# EAGLE design button_controller_v1.0 (EAGLE 9.6.2)
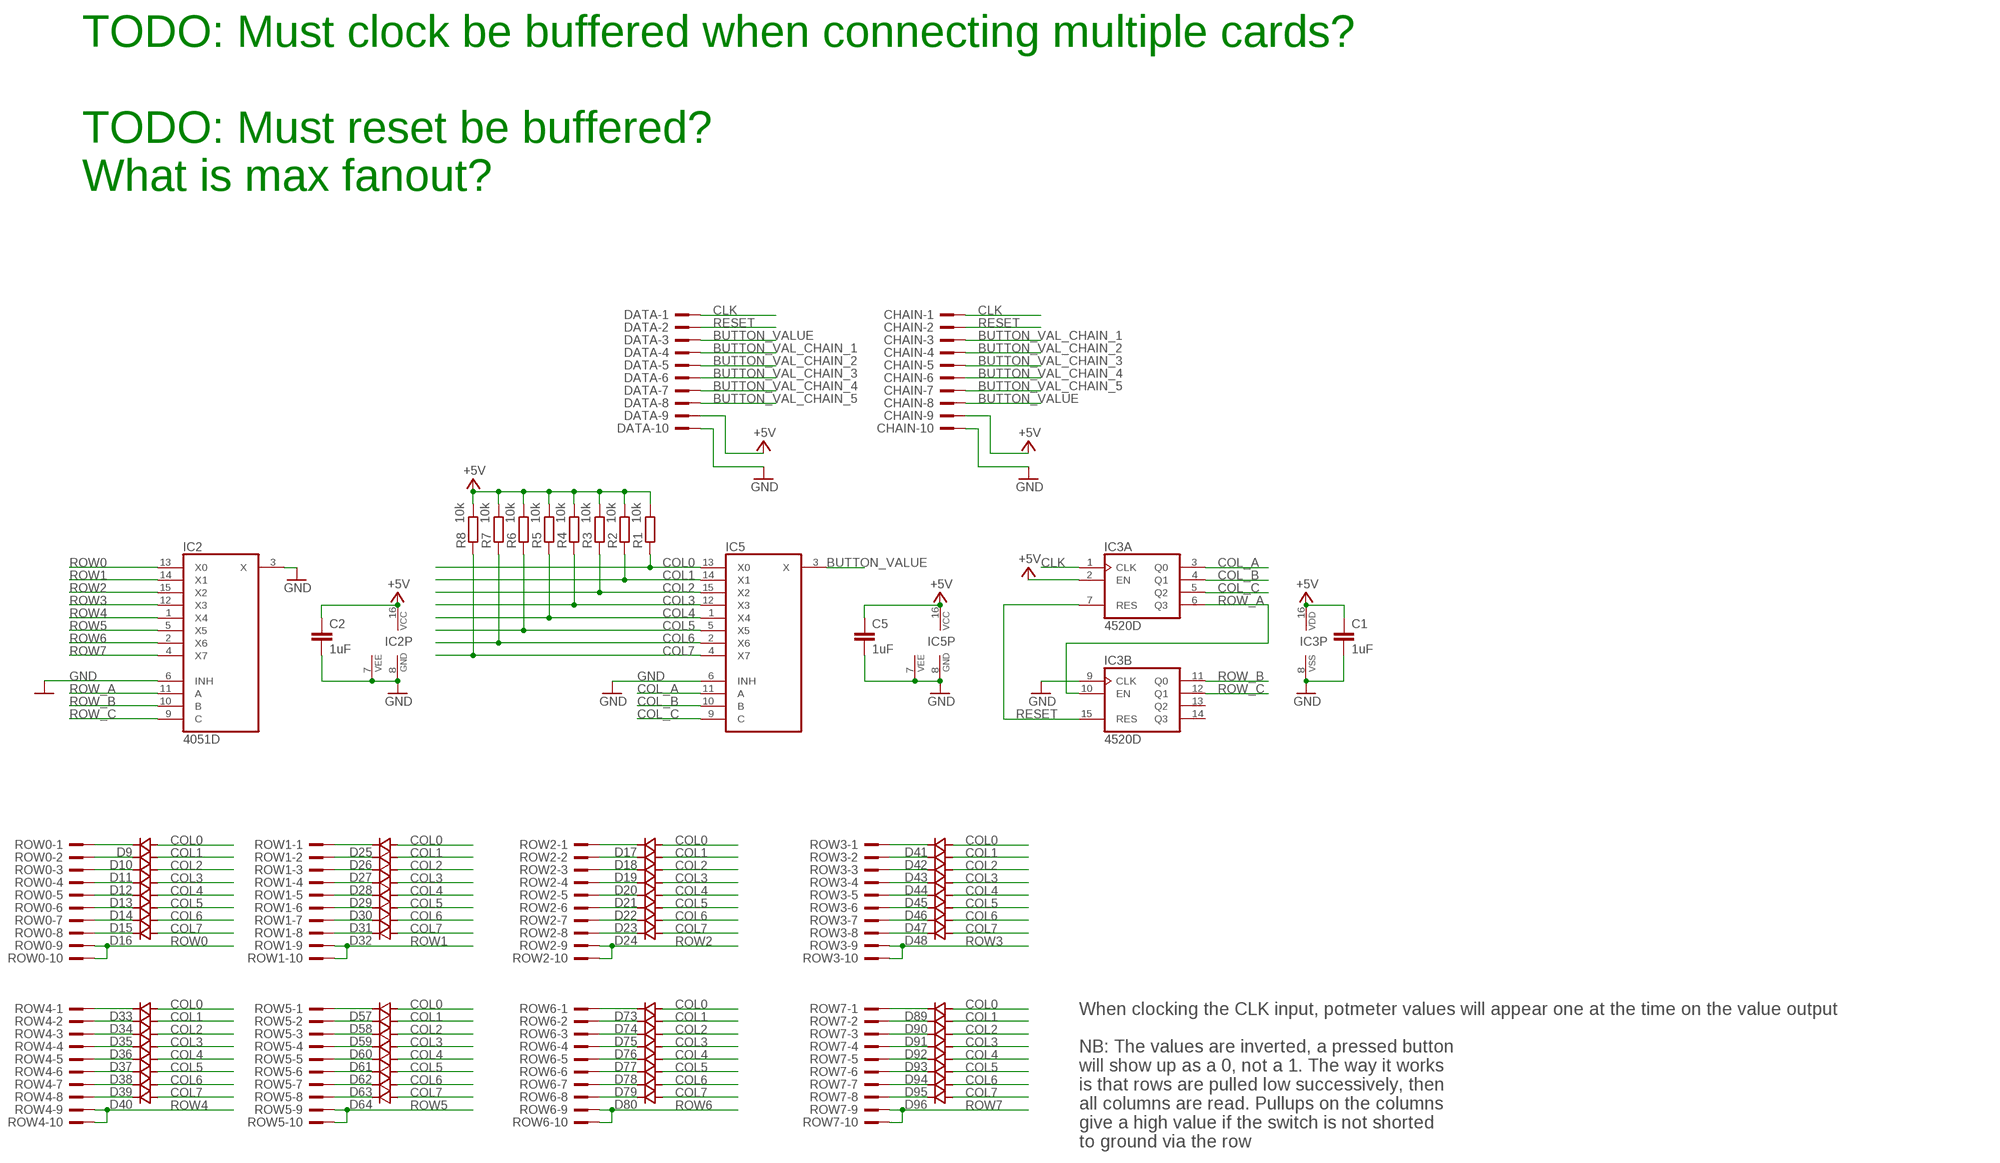
[diagram p0: schematic, sheet 1]

## Parts
C1  1uF  C-EU-J0603  [C0603-J]
C2  1uF  C-EU-J0603  [C0603-J]
C5  1uF  C-EU-J0603  [C0603-J]
CHAIN  CONN-IDC-10PS  [CONN-IDC10P-S]
D9  1N4148SOD323  [SOD323J]
D10  1N4148SOD323  [SOD323J]
D11  1N4148SOD323  [SOD323J]
D12  1N4148SOD323  [SOD323J]
D13  1N4148SOD323  [SOD323J]
D14  1N4148SOD323  [SOD323J]
D15  1N4148SOD323  [SOD323J]
D16  1N4148SOD323  [SOD323J]
D17  1N4148SOD323  [SOD323J]
D18  1N4148SOD323  [SOD323J]
D19  1N4148SOD323  [SOD323J]
D20  1N4148SOD323  [SOD323J]
D21  1N4148SOD323  [SOD323J]
D22  1N4148SOD323  [SOD323J]
D23  1N4148SOD323  [SOD323J]
D24  1N4148SOD323  [SOD323J]
D25  1N4148SOD323  [SOD323J]
D26  1N4148SOD323  [SOD323J]
D27  1N4148SOD323  [SOD323J]
D28  1N4148SOD323  [SOD323J]
D29  1N4148SOD323  [SOD323J]
D30  1N4148SOD323  [SOD323J]
D31  1N4148SOD323  [SOD323J]
D32  1N4148SOD323  [SOD323J]
D33  1N4148SOD323  [SOD323J]
D34  1N4148SOD323  [SOD323J]
D35  1N4148SOD323  [SOD323J]
D36  1N4148SOD323  [SOD323J]
D37  1N4148SOD323  [SOD323J]
D38  1N4148SOD323  [SOD323J]
D39  1N4148SOD323  [SOD323J]
D40  1N4148SOD323  [SOD323J]
D41  1N4148SOD323  [SOD323J]
D42  1N4148SOD323  [SOD323J]
D43  1N4148SOD323  [SOD323J]
D44  1N4148SOD323  [SOD323J]
D45  1N4148SOD323  [SOD323J]
D46  1N4148SOD323  [SOD323J]
D47  1N4148SOD323  [SOD323J]
D48  1N4148SOD323  [SOD323J]
D57  1N4148SOD323  [SOD323J]
D58  1N4148SOD323  [SOD323J]
D59  1N4148SOD323  [SOD323J]
D60  1N4148SOD323  [SOD323J]
D61  1N4148SOD323  [SOD323J]
D62  1N4148SOD323  [SOD323J]
D63  1N4148SOD323  [SOD323J]
D64  1N4148SOD323  [SOD323J]
D73  1N4148SOD323  [SOD323J]
D74  1N4148SOD323  [SOD323J]
D75  1N4148SOD323  [SOD323J]
D76  1N4148SOD323  [SOD323J]
D77  1N4148SOD323  [SOD323J]
D78  1N4148SOD323  [SOD323J]
D79  1N4148SOD323  [SOD323J]
D80  1N4148SOD323  [SOD323J]
D89  1N4148SOD323  [SOD323J]
D90  1N4148SOD323  [SOD323J]
D91  1N4148SOD323  [SOD323J]
D92  1N4148SOD323  [SOD323J]
D93  1N4148SOD323  [SOD323J]
D94  1N4148SOD323  [SOD323J]
D95  1N4148SOD323  [SOD323J]
D96  1N4148SOD323  [SOD323J]
DATA  CONN-IDC-10PS  [CONN-IDC10P-S]
IC2  4051D  [SO16]
IC3  4520D  [SO16]
IC5  4051D  [SO16]
R1  10k  R-EU_R0603  [R0603]
R2  10k  R-EU_R0603  [R0603]
R3  10k  R-EU_R0603  [R0603]
R4  10k  R-EU_R0603  [R0603]
R5  10k  R-EU_R0603  [R0603]
R6  10k  R-EU_R0603  [R0603]
R7  10k  R-EU_R0603  [R0603]
R8  10k  R-EU_R0603  [R0603]
ROW0  CONN-IDC-10PS  [CONN-IDC10P-S]
ROW1  CONN-IDC-10PS  [CONN-IDC10P-S]
ROW2  CONN-IDC-10PS  [CONN-IDC10P-S]
ROW3  CONN-IDC-10PS  [CONN-IDC10P-S]
ROW4  CONN-IDC-10PS  [CONN-IDC10P-S]
ROW5  CONN-IDC-10PS  [CONN-IDC10P-S]
ROW6  CONN-IDC-10PS  [CONN-IDC10P-S]
ROW7  CONN-IDC-10PS  [CONN-IDC10P-S]

## Nets
+5V: C1.1 C2.1 C5.1 CHAIN.9 DATA.9 IC2.16(VCC) IC3.2(A:EN) IC3.16(P:VDD) IC5.16(VCC) R1.2 R2.2 R3.2 R4.2 R5.2 R6.2 R7.2 R8.2
BUTTON_VAL_CHAIN_1: CHAIN.3 DATA.4
BUTTON_VAL_CHAIN_2: CHAIN.4 DATA.5
BUTTON_VAL_CHAIN_3: CHAIN.5 DATA.6
BUTTON_VAL_CHAIN_4: CHAIN.6 DATA.7
BUTTON_VAL_CHAIN_5: CHAIN.7 DATA.8
BUTTON_VALUE: CHAIN.8 DATA.3 IC5.3(X)
CLK: CHAIN.1 DATA.1 IC3.1(A:CLK)
COL0: D9.2(A) D17.2(A) D25.2(A) D33.2(A) D41.2(A) D57.2(A) D73.2(A) D89.2(A) IC5.13(X0) R1.1
COL1: D10.2(A) D18.2(A) D26.2(A) D34.2(A) D42.2(A) D58.2(A) D74.2(A) D90.2(A) IC5.14(X1) R2.1
COL2: D11.2(A) D19.2(A) D27.2(A) D35.2(A) D43.2(A) D59.2(A) D75.2(A) D91.2(A) IC5.15(X2) R3.1
COL3: D12.2(A) D20.2(A) D28.2(A) D36.2(A) D44.2(A) D60.2(A) D76.2(A) D92.2(A) IC5.12(X3) R4.1
COL4: D13.2(A) D21.2(A) D29.2(A) D37.2(A) D45.2(A) D61.2(A) D77.2(A) D93.2(A) IC5.1(X4) R5.1
COL5: D14.2(A) D22.2(A) D30.2(A) D38.2(A) D46.2(A) D62.2(A) D78.2(A) D94.2(A) IC5.5(X5) R6.1
COL6: D15.2(A) D23.2(A) D31.2(A) D39.2(A) D47.2(A) D63.2(A) D79.2(A) D95.2(A) IC5.2(X6) R7.1
COL7: D16.2(A) D24.2(A) D32.2(A) D40.2(A) D48.2(A) D64.2(A) D80.2(A) D96.2(A) IC5.4(X7) R8.1
COL_A: IC3.3(A:Q0) IC5.11(A)
COL_B: IC3.4(A:Q1) IC5.10(B)
COL_C: IC3.5(A:Q2) IC5.9(C)
GND: C1.2 C2.2 C5.2 CHAIN.10 DATA.10 IC2.3(X) IC2.6(INH) IC2.7(VEE) IC2.8(GND) IC3.8(P:VSS) IC3.9(B:CLK) IC5.6(INH) IC5.7(VEE) IC5.8(GND)
N$9: D9.1(C) ROW0.1
N$10: D10.1(C) ROW0.2
N$11: D11.1(C) ROW0.3
N$12: D12.1(C) ROW0.4
N$13: D13.1(C) ROW0.5
N$14: D14.1(C) ROW0.6
N$15: D15.1(C) ROW0.7
N$16: D16.1(C) ROW0.8
N$17: D17.1(C) ROW2.1
N$18: D18.1(C) ROW2.2
N$19: D19.1(C) ROW2.3
N$20: D20.1(C) ROW2.4
N$21: D21.1(C) ROW2.5
N$22: D22.1(C) ROW2.6
N$23: D23.1(C) ROW2.7
N$24: D24.1(C) ROW2.8
N$25: D25.1(C) ROW1.1
N$26: D26.1(C) ROW1.2
N$27: D27.1(C) ROW1.3
N$28: D28.1(C) ROW1.4
N$29: D29.1(C) ROW1.5
N$30: D30.1(C) ROW1.6
N$31: D31.1(C) ROW1.7
N$32: D32.1(C) ROW1.8
N$33: D33.1(C) ROW4.1
N$34: D34.1(C) ROW4.2
N$35: D35.1(C) ROW4.3
N$36: D36.1(C) ROW4.4
N$37: D37.1(C) ROW4.5
N$38: D38.1(C) ROW4.6
N$39: D39.1(C) ROW4.7
N$40: D40.1(C) ROW4.8
N$41: D41.1(C) ROW3.1
N$42: D42.1(C) ROW3.2
N$43: D43.1(C) ROW3.3
N$44: D44.1(C) ROW3.4
N$45: D45.1(C) ROW3.5
N$46: D46.1(C) ROW3.6
N$47: D47.1(C) ROW3.7
N$48: D48.1(C) ROW3.8
N$57: D57.1(C) ROW5.1
N$58: D58.1(C) ROW5.2
N$59: D59.1(C) ROW5.3
N$60: D60.1(C) ROW5.4
N$61: D61.1(C) ROW5.5
N$62: D62.1(C) ROW5.6
N$63: D63.1(C) ROW5.7
N$64: D64.1(C) ROW5.8
N$73: D73.1(C) ROW6.1
N$74: D74.1(C) ROW6.2
N$75: D75.1(C) ROW6.3
N$76: D76.1(C) ROW6.4
N$77: D77.1(C) ROW6.5
N$78: D78.1(C) ROW6.6
N$79: D79.1(C) ROW6.7
N$80: D80.1(C) ROW6.8
N$89: D89.1(C) ROW7.1
N$90: D90.1(C) ROW7.2
N$91: D91.1(C) ROW7.3
N$92: D92.1(C) ROW7.4
N$93: D93.1(C) ROW7.5
N$94: D94.1(C) ROW7.6
N$95: D95.1(C) ROW7.7
N$96: D96.1(C) ROW7.8
RESET: CHAIN.2 DATA.2 IC3.7(A:RES) IC3.15(B:RES)
ROW0: IC2.13(X0) ROW0.9 ROW0.10
ROW1: IC2.14(X1) ROW1.9 ROW1.10
ROW2: IC2.15(X2) ROW2.9 ROW2.10
ROW3: IC2.12(X3) ROW3.9 ROW3.10
ROW4: IC2.1(X4) ROW4.9 ROW4.10
ROW5: IC2.5(X5) ROW5.9 ROW5.10
ROW6: IC2.2(X6) ROW6.9 ROW6.10
ROW7: IC2.4(X7) ROW7.9 ROW7.10
ROW_A: IC2.11(A) IC3.6(A:Q3) IC3.10(B:EN)
ROW_B: IC2.10(B) IC3.11(B:Q0)
ROW_C: IC2.9(C) IC3.12(B:Q1)
Unconnected: IC3.13(B:Q2) IC3.14(B:Q3)

## Notes on the sheet
- TODO: Must clock be buffered when connecting multiple cards?
  
  TODO: Must reset be buffered?
  What is max fanout?
- When clocking the CLK input, potmeter values will appear one at the time on the value output
  
  NB: The values are inverted, a pressed button
  will show up as a 0, not a 1. The way it works
  is that rows are pulled low successively, then
  all columns are read. Pullups on the columns
  give a high value if the switch is not shorted
  to ground via the row

## Library data of the parts
C1 C2 C5 = joakim:C-EU-J: CAPACITOR, European symbol
CHAIN DATA ROW0 ROW1-ROW7 = joakim:CONN-IDC-10P: 10P IDC Header
D9-D48 D57-D64 D73-D80 D89-D96 = joakim:1N4148: DIODE high speed (Philips)
IC2 IC5 = 40xx:4051: 8-channel ANALOG MULTIPLEXER
IC3 = 45xx:4520: Dual binary up COUNTER
R1-R8 = rcl:R-EU_: RESISTOR, European symbol; SPICEPREFIX: R

## Board
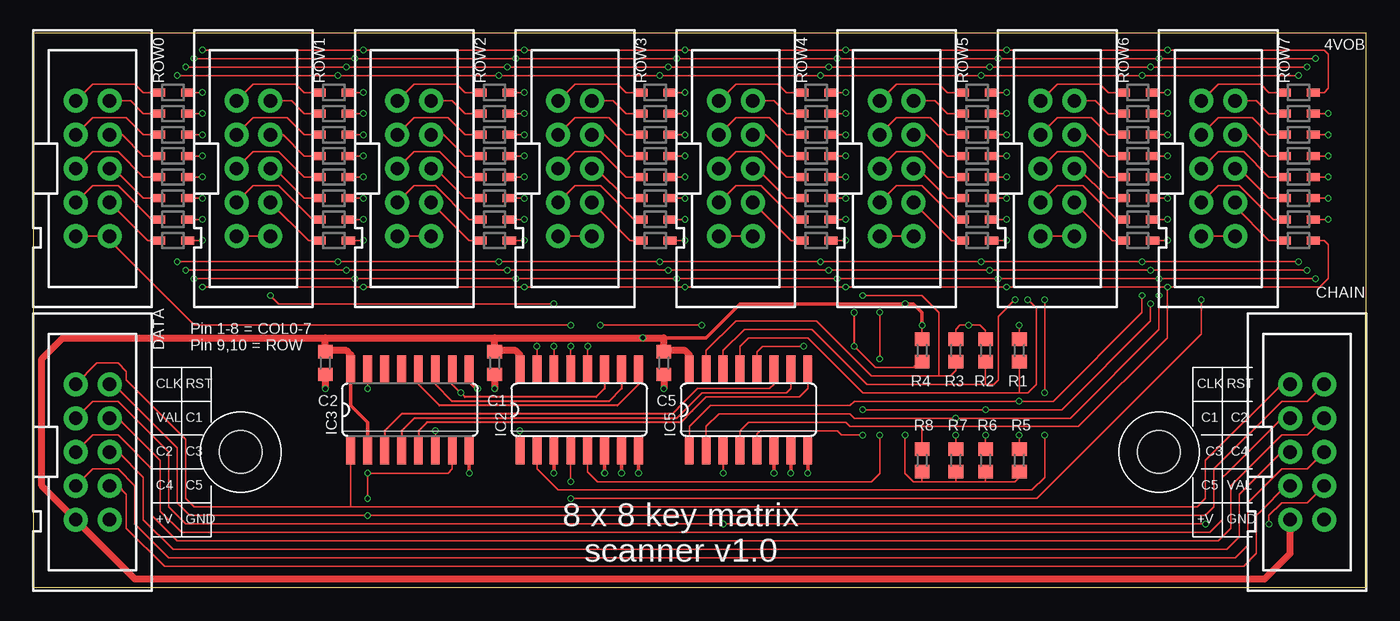
[diagram p1: board, top side]
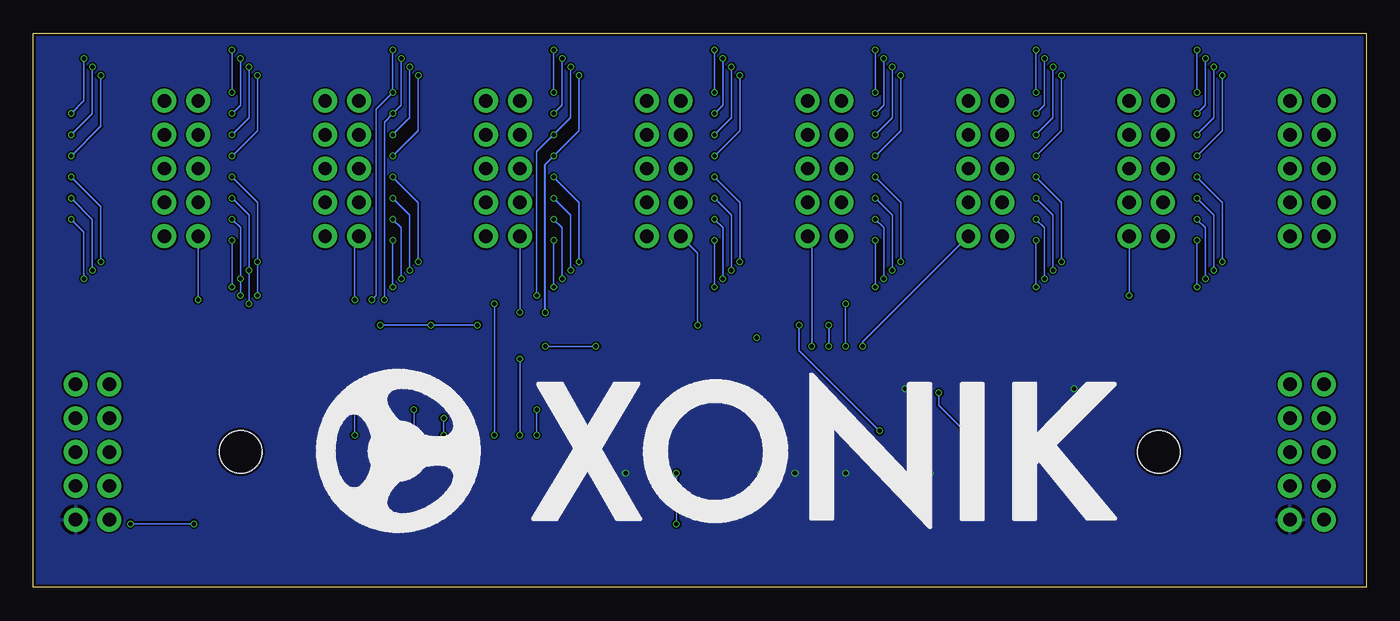
[diagram p2: board, bottom side, seen from below]

Size 100 x 41.59 mm. Coordinates in mm from the lower left corner, seen from the top.
Outline: 0,0 100,0 100,41.59 0,41.59 0,0
Copper layers (1*16): Top 0.035mm / dielectric 1.6mm / Bottom 0.035mm
Design rules "jlcpcb-2layers": minimum track width 5mil, minimum drill 0.3mm, track to track 5mil, track to pad 5mil, pad to pad 5mil, via to via 5mil, smd to smd 5mil, copper to edge 0.2mm, drill to drill 6mil, minimum pad ring 10mil, minimum via ring 3mil, stop-mask expansion 4mil, vias tented up to drill 0mil, thermal gap 10mil
Holes 3.2 mm at 15.56,10.16 84.45,10.16

### Footprints (pad centres in the part's own frame; a part is rotated, then mirrored left to right if it is on the bottom)
C0603-J = smd 1 x 1.1: 1 -0.85,0; 2 0.85,0
CONN-IDC10P-S = drill 1 pad 1.422: 1 -5.08,-1.27; 2 -5.08,1.27; 3 -2.54,-1.27; 4 -2.54,1.27; 5 0,-1.27; 6 0,1.27; 7 2.54,-1.27; 8 2.54,1.27; 9 5.08,-1.27; 10 5.08,1.27
SOD323J = smd 1 x 0.6: 1 -1.1,0; 2 1.1,0
SO16 = smd 0.66 x 2.032: 1 -4.445,-3.073; 2 -3.175,-3.073; 3 -1.905,-3.073; 4 -0.635,-3.073; 5 0.635,-3.073; 6 1.905,-3.073; 7 3.175,-3.073; 8 4.445,-3.073; 9 4.445,3.073; 10 3.175,3.073; 11 1.905,3.073; 12 0.635,3.073; 13 -0.635,3.073; 14 -1.905,3.073; 15 -3.175,3.073; 16 -4.445,3.073
R0603 = smd 1 x 1.1: 1 -0.85,0; 2 0.85,0

### Placement (x,y rotation side)
C1  34.61,16.83 270 top
C2  21.91,16.83 270 top
C5  47.31,16.83 270 top
CHAIN  95.57,10.16 270 top
D9  10.48,37.15 0 top
D10  10.48,35.56 0 top
D11  10.48,33.97 0 top
D12  10.48,32.38 0 top
D13  10.48,30.8 0 top
D14  10.48,29.21 0 top
D15  10.48,27.62 0 top
D16  10.48,26.04 0 top
D17  34.61,37.15 0 top
D18  34.61,35.56 0 top
D19  34.61,33.97 0 top
D20  34.61,32.38 0 top
D21  34.61,30.8 0 top
D22  34.61,29.21 0 top
D23  34.61,27.62 0 top
D24  34.61,26.04 0 top
D25  22.54,37.15 0 top
D26  22.54,35.56 0 top
D27  22.54,33.97 0 top
D28  22.54,32.38 0 top
D29  22.54,30.8 0 top
D30  22.54,29.21 0 top
D31  22.54,27.62 0 top
D32  22.54,26.04 0 top
D33  58.74,37.15 0 top
D34  58.74,35.56 0 top
D35  58.74,33.97 0 top
D36  58.74,32.38 0 top
D37  58.74,30.8 0 top
D38  58.74,29.21 0 top
D39  58.74,27.62 0 top
D40  58.74,26.04 0 top
D41  46.67,37.15 0 top
D42  46.67,35.56 0 top
D43  46.67,33.97 0 top
D44  46.67,32.38 0 top
D45  46.67,30.8 0 top
D46  46.67,29.21 0 top
D47  46.67,27.62 0 top
D48  46.67,26.04 0 top
D57  70.8,37.15 0 top
D58  70.8,35.56 0 top
D59  70.8,33.97 0 top
D60  70.8,32.38 0 top
D61  70.8,30.8 0 top
D62  70.8,29.21 0 top
D63  70.8,27.62 0 top
D64  70.8,26.04 0 top
D73  82.87,37.15 0 top
D74  82.87,35.56 0 top
D75  82.87,33.97 0 top
D76  82.87,32.38 0 top
D77  82.87,30.8 0 top
D78  82.87,29.21 0 top
D79  82.87,27.62 0 top
D80  82.87,26.04 0 top
D89  94.93,37.15 0 top
D90  94.93,35.56 0 top
D91  94.93,33.97 0 top
D92  94.93,32.38 0 top
D93  94.93,30.8 0 top
D94  94.93,29.21 0 top
D95  94.93,27.62 0 top
D96  94.93,26.04 0 top
DATA  4.45,10.16 270 top
IC2  40.96,13.34 0 top
IC3  28.26,13.34 0 top
IC5  53.66,13.34 0 top
R1  73.98,17.78 90 top
R2  71.44,17.78 90 top
R3  69.22,17.78 90 top
R4  66.67,17.78 90 top
R5  73.98,9.53 270 top
R6  71.44,9.53 270 top
R7  69.22,9.53 270 top
R8  66.67,9.53 270 top
ROW0  4.45,31.43 270 top
ROW1  16.51,31.43 270 top
ROW2  28.57,31.43 270 top
ROW3  40.64,31.43 270 top
ROW4  52.7,31.43 270 top
ROW5  64.77,31.43 270 top
ROW6  76.83,31.43 270 top
ROW7  88.9,31.43 270 top
U$1  [XONIK_LOGO_60]  78.74,4.13 0 bottom

### Tracks (layer width: path | path; a pad name or v marks a point on that pad's centre or on a via)
+5V  (via drill 0.33)
  Top 0.127: R1.2 v73.98,19.68 | v65.41,11.43 65.41,8.57 66.04,7.94 66.67,7.94 | R2.2 71.44,19.27 71.02,19.68 v70.17,19.68 69.53,19.68 69.22,19.37 R3.2 | R5.2 73.98,8.26 73.66,7.94 71.44,7.94 | 71.44,7.94 69.22,7.94 | 69.22,7.94 66.67,7.94 | R8.2 66.67,7.94 | R7.2 69.22,7.94 | R6.2 71.44,7.94 | v66.67,19.68 R4.2
  Top 0.254: IC3.2 25.08,12.38 23.81,13.65 IC3.16 | v66.67,19.68 66.67,20.64 66.04,21.27 v65.41,21.27 53.02,21.27 50.48,18.73 47.31,18.73
  Top 0.508: 21.91,18.73 C2.1 22.01,17.78 23.5,17.78 23.81,17.46 IC3.16 | 21.91,18.73 34.61,18.73 | 47.31,17.78 47.31,18.73 v45.72,18.73 34.61,18.73 | 47.31,17.78 C5.1 | C1.1 34.61,17.78 | 34.61,17.78 34.61,18.73 | IC2.16 36.51,17.46 36.2,17.78 34.61,17.78 | IC5.16 49.21,17.46 48.9,17.78 47.31,17.78 | 21.91,18.73 2.22,18.73 0.64,17.14 0.64,7.62 DATA.9 7.62,0.64 92.39,0.64 94.3,2.54 CHAIN.9
  Bottom 0.127: v65.41,21.27 v65.41,11.43 | v73.98,19.68 v70.17,19.68 v66.67,19.68
BUTTON_VAL_CHAIN_1
  Top 0.127: CHAIN.3 93.66,12.7 89.53,8.57 89.22,8.26 89.22,5.08 88.27,4.13 85.09,4.13 11.11,4.13 9.53,5.71 9.53,9.53 6.35,12.7 DATA.4
BUTTON_VAL_CHAIN_2
  Top 0.127: DATA.5 4.45,11.43 6.35,11.43 8.89,8.89 8.89,5.4 10.79,3.49 85.72,3.49 88.9,3.49 89.85,4.45 89.85,7.62 93.66,11.43 95.57,11.43 CHAIN.4
BUTTON_VAL_CHAIN_3
  Top 0.127: CHAIN.5 93.66,10.16 90.49,6.99 90.49,3.81 89.53,2.86 86.36,2.86 10.48,2.86 8.26,5.08 8.26,8.26 6.35,10.16 DATA.6
BUTTON_VAL_CHAIN_4
  Top 0.127: CHAIN.6 95.57,8.89 93.66,8.89 91.12,6.35 91.12,3.17 90.17,2.22 10.16,2.22 7.62,4.76 7.62,7.62 6.35,8.89 4.45,8.89 DATA.7
BUTTON_VAL_CHAIN_5
  Top 0.127: CHAIN.7 93.98,7.62 92.08,5.71 91.76,5.4 91.76,2.54 90.81,1.59 87.95,1.59 9.84,1.59 6.99,4.45 6.99,6.99 6.35,7.62 DATA.8
BUTTON_VALUE  (via drill 0.33)
  Top 0.127: CHAIN.8 95.57,6.35 93.66,6.35 92.71,5.4 v92.71,4.76 | DATA.3 4.45,13.97 6.35,13.97 10.16,10.16 10.16,6.03 11.43,4.76 v51.75,4.76 v87.95,4.76
  Top 0.152: IC5.3 v51.75,8.57
  Bottom 0.127: v51.75,8.57 v51.75,4.76 | v87.95,4.76 v92.71,4.76
CLK
  Top 0.127: CHAIN.1 93.66,15.24 87.95,9.53 87.95,6.67 87.31,6.03 23.81,6.03 | DATA.1 4.76,16.83 6.35,16.83 6.99,16.19 6.99,15.56 11.43,11.11 11.43,6.67 12.06,6.03 23.81,6.03 | IC3.1 23.81,6.03
COL0  (via drill 0.33)
  Top 0.127: 11.75,37.32 D9.2 v12.7,37.15 | 35.88,37.32 D17.2 v36.83,37.15 | 47.94,37.32 D41.2 v48.9,37.15 | 60.16,37.15 D33.2 v60.96,37.15 | 72.07,37.15 D57.2 v73.03,37.15 | 84.14,37.32 D73.2 v85.09,37.15 | IC5.13 53.02,18.1 53.66,18.73 58.1,18.73 62.23,14.61 73.98,14.61 | 73.98,14.61 74.61,14.61 75.25,15.24 75.25,20.95 v74.61,21.59 | D25.2 v24.77,37.15 | D89.2 96.84,37.15 97.16,37.47 97.16,40.01 96.84,40.32 v85.09,40.32 v73.03,40.32 v60.96,40.32 v48.9,40.32 v36.83,40.32 v24.77,40.32 v12.7,40.32 | R1.1 73.98,14.61
  Bottom 0.127: v24.77,37.15 v24.77,40.32 | v36.83,37.15 v36.83,40.32 | v48.9,37.15 v48.9,40.32 | v60.96,37.15 v60.96,40.32 | v73.03,40.32 v73.03,37.15 74.3,35.88 74.3,21.91 v74.61,21.59 | v85.09,37.15 v85.09,40.32 | v12.7,37.15 v12.7,40.32
COL1  (via drill 0.33)
  Top 0.127: D90.2 v97.16,35.56 | IC5.14 51.75,17.78 53.34,19.37 58.42,19.37 62.55,15.24 71.44,15.24 | 71.44,15.24 72.07,15.24 72.39,15.56 72.39,20.32 v73.66,21.59 | D26.2 v24.77,35.56 | D18.2 v36.83,35.56 | D42.2 v48.9,35.56 | D34.2 v60.96,35.56 | D58.2 v73.03,35.56 | D74.2 v85.09,35.56 | v12.06,39.69 v24.13,39.69 v36.2,39.69 v48.26,39.69 v60.33,39.69 v72.39,39.69 v84.45,39.69 v96.2,39.69 | D10.2 v12.7,35.56 | R2.1 71.44,15.24
  Bottom 0.127: v24.77,35.56 24.13,36.2 v24.13,39.69 | v36.83,35.56 36.2,36.2 v36.2,39.69 | v48.9,35.56 48.26,36.2 v48.26,39.69 | v60.96,35.56 60.33,36.2 v60.33,39.69 | v72.39,39.69 72.39,36.2 v73.03,35.56 73.66,34.92 v73.66,21.59 | v85.09,35.56 84.45,36.2 v84.45,39.69 | v96.2,39.69 96.2,36.51 v97.16,35.56 | v12.7,35.56 12.06,36.2 v12.06,39.69
COL2  (via drill 0.33)
  Top 0.127: D59.2 71.75,33.97 71.67,34.06 71.73,34.12 | D91.2 v97.16,33.97 | IC5.15 50.48,17.78 52.7,20 58.74,20 62.87,15.88 67.94,15.88 | 72.07,33.97 D59.2 | D27.2 v24.77,33.97 | D19.2 v36.83,33.97 | D43.2 v48.9,33.97 | D35.2 v60.96,33.97 | D59.2 v73.03,33.97 | D75.2 v85.09,33.97 | v95.57,39.05 v83.82,39.05 v71.75,39.05 v59.69,39.05 v47.62,39.05 v35.56,39.05 v23.5,39.05 v11.43,39.05 | D11.2 v12.7,33.97 | v62.23,21.91 66.67,21.91 67.94,20.64 67.94,15.88 | 67.94,15.88 68.8,15.88 69.22,16.3 R3.1
  Bottom 0.127: v24.77,33.97 23.5,35.24 v23.5,39.05 | v36.83,33.97 35.56,35.24 v35.56,39.05 | v48.9,33.97 47.62,35.24 v47.62,39.05 | v59.69,39.05 59.69,35.24 v60.96,33.97 62.23,32.7 v62.23,21.91 | v73.03,33.97 71.75,35.24 v71.75,39.05 | v85.09,33.97 83.82,35.24 v83.82,39.05 | v97.16,33.97 95.57,35.56 v95.57,39.05 | v12.7,33.97 11.43,35.24 v11.43,39.05
COL3  (via drill 0.33, 0.35)
  Top 0.127: D92.2 v97.16,32.38 | v57.78,18.1 54.71,18.1 54.29,17.68 IC5.12 | 66.04,16.51 63.18,16.51 v61.59,18.1 | 66.04,16.51 66.99,16.51 | v10.79,38.42 v22.86,38.42 v34.92,38.42 v46.99,38.42 v59.05,38.42 v71.12,38.42 v83.19,38.42 v94.93,38.42 | D28.2 v24.77,32.38 | D20.2 v36.83,32.38 | D44.2 v48.9,32.38 | D36.2 v60.96,32.38 | D60.2 v73.03,32.38 | D76.2 v85.09,32.38 | D12.2 v12.7,32.38 | 66.04,16.51 66.46,16.93 R4.1
  Top 0.152: v61.59,18.1 v61.59,20.64
  Bottom 0.127: v24.77,32.38 22.86,34.29 v22.86,38.42 | v36.83,32.38 34.92,34.29 v34.92,38.42 | v48.9,32.38 46.99,34.29 v46.99,38.42 | v59.05,38.42 59.05,34.29 v60.96,32.38 61.59,31.75 | v73.03,32.38 71.12,34.29 v71.12,38.42 | v85.09,32.38 83.19,34.29 v83.19,38.42 | v97.16,32.38 94.93,34.61 v94.93,38.42 | v12.7,32.38 10.79,34.29 v10.79,38.42 | v61.59,18.1 v57.78,18.1
  Bottom 0.152: v61.59,20.64 61.59,31.75
COL4  (via drill 0.33)
  Top 0.127: D93.2 v97.16,30.8 | v10.79,24.45 v22.86,24.45 v34.92,24.45 v46.99,24.45 v59.05,24.45 v71.12,24.45 v83.19,24.45 v94.93,24.45 | D29.2 v24.77,30.8 | D13.2 v12.7,30.8 | D21.2 v36.83,30.8 | D45.2 v48.9,30.8 | D37.2 v60.96,30.8 | D61.2 v73.03,30.8 | D77.2 v85.09,30.8 | v83.19,21.91 83.19,20.64 76.52,13.97 v73.98,13.97 61.59,13.97 61.28,13.65 50.8,13.65 49.21,12.06 IC5.1 | R5.1 74.07,10.39 73.98,10.48 v73.98,11.43
  Bottom 0.127: v94.93,24.45 94.93,28.57 v97.16,30.8 | v24.77,30.8 22.86,28.89 v22.86,24.45 | v12.7,30.8 10.79,28.89 v10.79,24.45 | v36.83,30.8 34.92,28.89 v34.92,24.45 | v48.9,30.8 46.99,28.89 v46.99,24.45 | v60.96,30.8 59.05,28.89 v59.05,24.45 | v73.03,30.8 71.12,28.89 v71.12,24.45 | v85.09,30.8 83.19,28.89 v83.19,24.45 v83.19,21.91 | v73.98,11.43 v73.98,13.97
COL5  (via drill 0.33)
  Top 0.127: D94.2 v97.16,29.21 | 47.94,29.21 D46.2 v48.9,29.21 | v11.43,23.81 v23.5,23.81 v35.56,23.81 v47.62,23.81 v59.69,23.81 v71.75,23.81 v83.82,23.81 v95.57,23.81 | D30.2 v24.77,29.21 | D14.2 v12.7,29.21 | D22.2 v36.83,29.21 | D38.2 v60.96,29.21 | D62.2 v73.03,29.21 | D78.2 v85.09,29.21 | v83.82,21.27 83.82,20 77.15,13.34 v71.44,13.34 v62.23,13.34 | IC5.5 54.29,11.53 54.51,11.75 60.33,11.75 60.64,11.43 v62.23,11.43 | R6.1 v71.44,11.43
  Bottom 0.127: v95.57,23.81 95.57,27.62 v97.16,29.21 | v24.77,29.21 23.5,27.94 v23.5,23.81 | v12.7,29.21 11.43,27.94 v11.43,23.81 | v36.83,29.21 35.56,27.94 v35.56,23.81 | v48.9,29.21 47.62,27.94 v47.62,23.81 | v60.96,29.21 59.69,27.94 v59.69,23.81 | v73.03,29.21 71.75,27.94 v71.75,23.81 | v85.09,29.21 83.82,27.94 v83.82,23.81 v83.82,21.27 | v62.23,13.34 v62.23,11.43 | v71.44,11.43 v71.44,13.34
COL6  (via drill 0.33)
  Top 0.127: 60.16,27.62 D39.2 v60.96,27.62 | 72.07,27.45 D63.2 v73.03,27.62 | D95.2 v97.16,27.62 | 47.94,27.62 D47.2 v48.9,27.62 | v12.06,23.18 v24.13,23.18 v36.2,23.18 v48.26,23.18 v60.33,23.18 v72.39,23.18 v84.45,23.18 v96.2,23.18 | D31.2 v24.77,27.62 | D15.2 v12.7,27.62 | D23.2 v36.83,27.62 | D79.2 v85.09,27.62 | v84.45,21.91 84.45,19.37 77.79,12.7 v69.22,12.7 61.59,12.7 61.28,13.02 51.44,13.02 50.48,12.06 IC5.2 | R7.1 v69.22,11.43
  Bottom 0.127: v96.2,23.18 96.2,26.67 v97.16,27.62 | v24.77,27.62 24.13,26.99 v24.13,23.18 | v12.7,27.62 12.06,26.99 v12.06,23.18 | v36.83,27.62 36.2,26.99 v36.2,23.18 | v48.9,27.62 48.26,26.99 v48.26,23.18 | v60.96,27.62 60.33,26.99 v60.33,23.18 | v73.03,27.62 72.39,26.99 v72.39,23.18 | v85.09,27.62 84.45,26.99 v84.45,23.18 v84.45,21.91 | v69.22,11.43 v69.22,12.7
COL7  (via drill 0.33)
  Top 0.127: 11.75,25.86 D16.2 v12.7,26.04 | 23.81,25.86 D32.2 v24.77,26.04 | 35.88,25.86 D24.2 v36.83,26.04 | 60.01,25.86 D40.2 v60.96,26.04 | 71.75,25.86 71.9,26.01 D64.2 v73.03,26.04 | 84.14,25.86 D80.2 v85.09,26.04 | D96.2 96.84,26.04 97.16,25.72 97.16,23.18 96.52,22.54 v85.09,22.54 | v12.7,22.54 v24.77,22.54 v36.83,22.54 v48.9,22.54 v60.96,22.54 v73.03,22.54 v85.09,22.54 | D48.2 v48.9,26.04 | IC5.4 53.02,11.75 53.66,12.38 60.96,12.38 61.28,12.06 66.67,12.06 | 66.67,12.06 78.42,12.06 85.09,18.73 v85.09,22.54 | R8.1 66.67,12.06
  Bottom 0.127: v24.77,26.04 v24.77,22.54 | v12.7,26.04 v12.7,22.54 | v36.83,26.04 v36.83,22.54 | v48.9,26.04 v48.9,22.54 | v60.96,26.04 v60.96,22.54 | v73.03,26.04 v73.03,22.54 | v85.09,26.04 v85.09,22.54
COL_A
  Top 0.127: 48.79,13.87 49.85,14.92 55.24,14.92 55.56,15.24 IC5.11
  Top 0.152: 48.79,13.87 47.94,13.02 27.62,13.02 26.35,11.75 IC3.3
COL_B
  Top 0.127: 49.11,13.55 50.16,14.61 56.52,14.61 56.83,14.92 IC5.10
  Top 0.152: 49.11,13.55 48.26,12.7 28.57,12.7 27.62,11.75 IC3.4
COL_C
  Top 0.127: 49.43,13.23 50.48,14.29 57.47,14.29 58.1,14.92 IC5.9
  Top 0.152: 49.43,13.23 48.58,12.38 29.53,12.38 28.89,11.75 IC3.5
GND  (via drill 0.33, 0.35)
  Top 0.254: IC2.3 v39.05,8.57 | IC2.6 v42.86,8.57 | IC2.7 v44.13,8.57 | IC2.8 v45.4,8.57 | IC3.8 v32.7,8.57 | v33.34,14.92 33.24,14.92 32.7,15.46 IC3.9 | IC5.7 v56.83,8.57 | IC5.8 v58.1,8.57 | IC5.6 v55.56,8.57
  Top 0.508: C5.2 v47.31,14.92 | C1.2 v34.61,14.92 | C2.2 v21.91,14.92
  pour Bottom: -0.95,42.86 101.28,42.86 101.28,-0.95 -0.95,-0.95
N$9
  Top 0.127: ROW0.1 4.45,37.78 7.62,37.78 8.26,37.15 D9.1
N$10
  Top 0.127: ROW0.2 7.3,36.51 8.26,35.56 D10.1
N$11
  Top 0.127: ROW0.3 4.45,35.24 6.99,35.24 8.26,33.97 D11.1
N$12
  Top 0.127: ROW0.4 6.67,33.97 8.26,32.38 D12.1
N$13
  Top 0.127: ROW0.5 4.45,32.7 6.35,32.7 8.26,30.8 D13.1
N$14
  Top 0.127: ROW0.6 6.03,31.43 8.26,29.21 D14.1
N$15
  Top 0.127: ROW0.7 4.45,30.16 6.35,30.16 8.89,27.62 D15.1
N$16
  Top 0.127: ROW0.8 8.57,26.04 D16.1
N$17
  Top 0.127: ROW2.1 28.57,37.78 31.75,37.78 32.38,37.15 D17.1
N$18
  Top 0.127: ROW2.2 31.43,36.51 32.38,35.56 D18.1
N$19
  Top 0.127: ROW2.3 28.57,35.24 31.11,35.24 32.38,33.97 D19.1
N$20
  Top 0.127: ROW2.4 30.8,33.97 32.38,32.38 D20.1
N$21
  Top 0.127: ROW2.5 28.57,32.7 30.48,32.7 32.38,30.8 D21.1
N$22
  Top 0.127: ROW2.6 30.16,31.43 32.38,29.21 D22.1
N$23
  Top 0.127: ROW2.7 28.57,30.16 30.16,30.16 32.7,27.62 D23.1
N$24
  Top 0.127: ROW2.8 32.7,26.04 D24.1
N$25
  Top 0.127: ROW1.1 16.51,37.78 19.68,37.78 20.32,37.15 D25.1
N$26
  Top 0.127: ROW1.2 19.37,36.51 20.32,35.56 D26.1
N$27
  Top 0.127: ROW1.3 16.51,35.24 19.05,35.24 20.32,33.97 D27.1
N$28
  Top 0.127: ROW1.4 18.73,33.97 20.32,32.38 D28.1
N$29
  Top 0.127: ROW1.5 16.51,32.7 18.41,32.7 20.32,30.8 D29.1
N$30
  Top 0.127: ROW1.6 18.1,31.43 20.32,29.21 D30.1
N$31
  Top 0.127: ROW1.7 16.51,30.16 18.41,30.16 20.95,27.62 D31.1
N$32
  Top 0.127: ROW1.8 20.64,26.04 D32.1
N$33
  Top 0.127: ROW4.1 52.7,37.78 55.88,37.78 56.52,37.15 D33.1
N$34
  Top 0.127: ROW4.2 55.56,36.51 56.52,35.56 D34.1
N$35
  Top 0.127: ROW4.3 52.7,35.24 55.24,35.24 56.52,33.97 D35.1
N$36
  Top 0.127: ROW4.4 54.93,33.97 56.52,32.38 D36.1
N$37
  Top 0.127: ROW4.5 52.7,32.7 54.61,32.7 56.52,30.8 D37.1
N$38
  Top 0.127: ROW4.6 54.29,31.43 56.52,29.21 D38.1
N$39
  Top 0.127: ROW4.7 52.7,30.16 54.61,30.16 57.15,27.62 D39.1
N$40
  Top 0.127: ROW4.8 56.83,26.04 D40.1
N$41
  Top 0.127: ROW3.1 40.64,37.78 43.81,37.78 44.45,37.15 D41.1
N$42
  Top 0.127: ROW3.2 43.5,36.51 44.45,35.56 D42.1
N$43
  Top 0.127: ROW3.3 40.64,35.24 43.18,35.24 44.45,33.97 D43.1
N$44
  Top 0.127: ROW3.4 42.86,33.97 44.45,32.38 D44.1
N$45
  Top 0.127: ROW3.5 40.64,32.7 42.55,32.7 44.45,30.8 D45.1
N$46
  Top 0.127: ROW3.6 42.23,31.43 44.45,29.21 D46.1
N$47
  Top 0.127: ROW3.7 40.64,30.16 42.55,30.16 45.09,27.62 D47.1
N$48
  Top 0.127: ROW3.8 44.77,26.04 D48.1
N$57
  Top 0.127: ROW5.1 64.77,37.78 67.94,37.78 68.58,37.15 D57.1
N$58
  Top 0.127: ROW5.2 67.63,36.51 68.58,35.56 D58.1
N$59
  Top 0.127: ROW5.3 64.77,35.24 67.31,35.24 68.58,33.97 D59.1
N$60
  Top 0.127: ROW5.4 66.99,33.97 68.58,32.38 D60.1
N$61
  Top 0.127: ROW5.5 64.77,32.7 66.67,32.7 68.58,30.8 D61.1
N$62
  Top 0.127: ROW5.6 66.36,31.43 68.58,29.21 D62.1
N$63
  Top 0.127: ROW5.7 64.77,30.16 66.67,30.16 69.22,27.62 D63.1
N$64
  Top 0.127: ROW5.8 68.9,26.04 D64.1
N$73
  Top 0.127: ROW6.1 76.83,37.78 80.01,37.78 80.64,37.15 D73.1
N$74
  Top 0.127: ROW6.2 79.69,36.51 80.64,35.56 D74.1
N$75
  Top 0.127: ROW6.3 76.83,35.24 79.38,35.24 80.64,33.97 D75.1
N$76
  Top 0.127: ROW6.4 79.06,33.97 80.64,32.38 D76.1
N$77
  Top 0.127: ROW6.5 76.83,32.7 78.74,32.7 80.64,30.8 D77.1
N$78
  Top 0.127: ROW6.6 78.42,31.43 80.64,29.21 D78.1
N$79
  Top 0.127: ROW6.7 76.83,30.16 78.74,30.16 81.28,27.62 D79.1
N$80
  Top 0.127: ROW6.8 80.96,26.04 D80.1
N$89
  Top 0.127: ROW7.1 88.9,37.78 92.08,37.78 92.71,37.15 D89.1
N$90
  Top 0.127: ROW7.2 91.76,36.51 92.71,35.56 D90.1
N$91
  Top 0.127: ROW7.3 88.9,35.24 91.44,35.24 92.71,33.97 D91.1
N$92
  Top 0.127: ROW7.4 91.12,33.97 92.71,32.38 D92.1
N$93
  Top 0.127: ROW7.5 88.9,32.7 90.81,32.7 92.71,30.8 D93.1
N$94
  Top 0.127: ROW7.6 90.49,31.43 92.71,29.21 D94.1
N$95
  Top 0.127: ROW7.7 88.9,30.16 90.49,30.16 93.03,27.62 D95.1
N$96
  Top 0.127: ROW7.8 90.17,28.57 92.71,26.04 D96.1
RESET  (via drill 0.33)
  Top 0.127: CHAIN.2 95.57,13.97 93.66,13.97 88.58,8.89 88.58,6.03 87.95,5.4 v25.08,5.4 11.75,5.4 10.79,6.35 10.79,10.48 6.03,15.24 DATA.2 | IC3.15 v25.08,14.92 | IC3.7 31.43,8.89 31.11,8.57 v25.08,8.57 v25.08,6.67
  Bottom 0.127: v25.08,14.92 v25.08,8.57 | v25.08,6.67 v25.08,5.4
ROW0  (via drill 0.33)
  Top 0.127: ROW0.9 ROW0.10 5.71,26.04 12.06,19.68 v40.32,19.68 | IC2.13 v40.32,18.1
  Bottom 0.127: v40.32,18.1 v40.32,19.68
ROW1  (via drill 0.33)
  Top 0.127: ROW1.9 ROW1.10 | IC2.14 v39.05,18.1 | v39.05,21.27 18.41,21.27 v17.78,21.91
  Bottom 0.127: v39.05,18.1 v39.05,21.27 | v17.78,21.91 ROW1.10
ROW2  (via drill 0.33)
  Top 0.127: ROW2.9 ROW2.10 | IC2.15 v37.78,18.1
  Bottom 0.127: v37.78,18.1 37.78,18.41 ROW2.10
ROW3  (via drill 0.33)
  Top 0.127: ROW3.9 ROW3.10 | IC2.12 v41.59,18.1
  Bottom 0.127: ROW3.10 41.59,26.04 v41.59,18.1
ROW4  (via drill 0.33)
  Top 0.127: ROW4.9 ROW4.10 | IC2.1 v36.51,11.75 | v42.55,19.68 v50.16,19.68
  Bottom 0.127: v36.51,11.75 42.55,17.78 v42.55,19.68 | v50.16,19.68 50.16,25.08 ROW4.9
ROW5  (via drill 0.33)
  Top 0.127: IC2.5 41.59,8.67 42.33,7.94 62.87,7.94 63.5,8.57 v63.5,11.43 | ROW5.9 ROW5.10 | v63.5,17.14 v63.5,20.64
  Bottom 0.127: v63.5,11.43 v63.5,17.14 | v63.5,20.64 ROW5.9
ROW6  (via drill 0.33)
  Top 0.127: ROW6.9 ROW6.10 | IC2.2 37.78,8.89 39.37,7.3 74.93,7.3 75.88,8.26 v75.88,11.43 | v75.88,21.59 v75.88,14.61
  Bottom 0.127: v75.88,14.61 v75.88,11.43 | ROW6.9 75.88,26.04 v75.88,21.59
ROW7  (via drill 0.33)
  Top 0.127: ROW7.9 ROW7.10 | IC2.4 v40.32,7.94 | v40.32,6.67 75.29,6.67 87.63,19.01 v87.63,21.59
  Bottom 0.127: v40.32,7.94 v40.32,6.67 | v87.63,21.59 ROW7.9
ROW_A  (via drill 0.33)
  Top 0.127: IC3.6 v30.16,11.75
  Top 0.152: IC2.11 42.86,14.92 42.23,14.29 32.38,14.29 v32.07,14.61 31.43,15.24 IC3.10
  Bottom 0.127: v30.16,11.75 32.07,13.65 v32.07,14.61
ROW_B
  Top 0.152: IC2.10 44.13,14.92 43.18,13.97 31.43,13.97 30.16,15.24 IC3.11
ROW_C
  Top 0.152: IC2.9 45.4,15.24 43.81,13.65 30.48,13.65 28.89,15.24 IC3.12

### Text on the board
tNames: 4VOB | Pin 1-8 = COL0-7 / Pin 9,10 = ROW | CLK | RST | CLK | RST | VAL | C1 | C1 | C2 | C2 | C3 | C3 | C4 | C4 | C5 | C5 | VAL | +V | GND | +V | GND | 8 x 8 key matrix / scanner v1.0